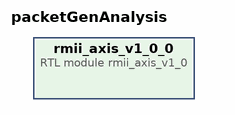
[diagram p0: block diagram of the top level]
# Vivado block design packetGenAnalysis, xc7a100tcsg324-1, Vivado 2024.1
create_bd_design packetGenAnalysis

create_bd_cell -type module -reference rmii_axis_v1_0 rmii_axis_v1_0_0

# ---- connections ----

validate_bd_design
save_bd_design
